# EAGLE schematic aw_101_alarm (EAGLE 6.4)
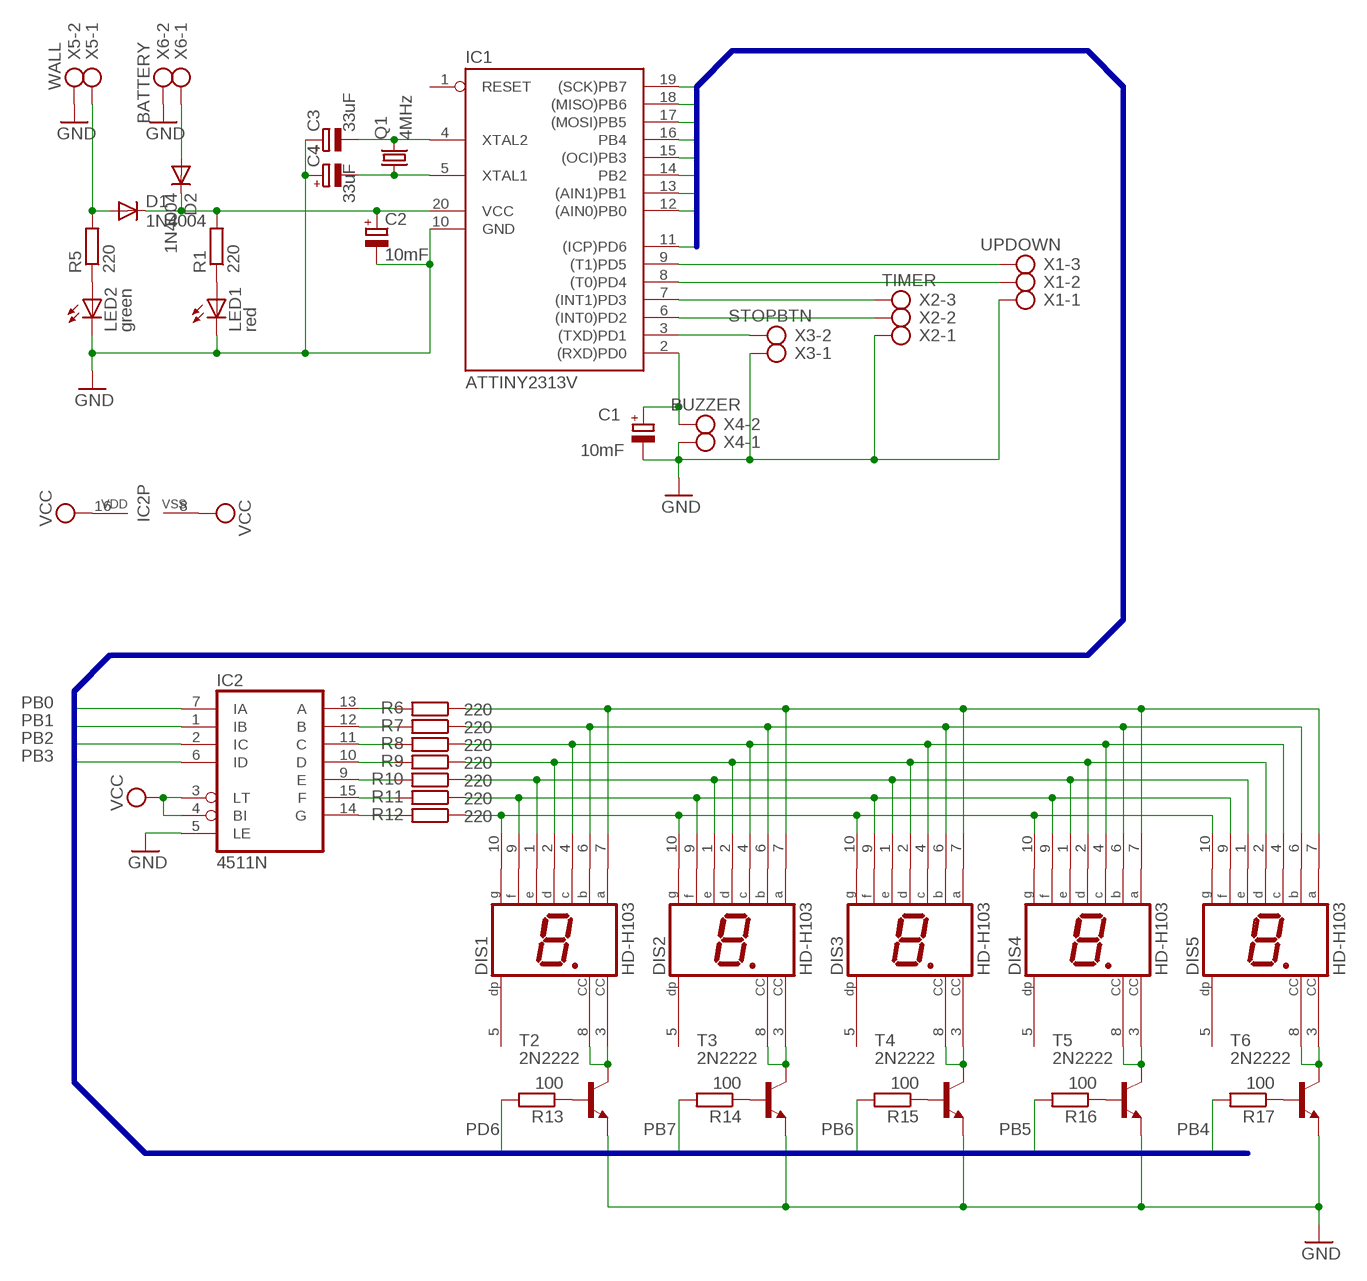
[diagram p0: schematic, sheet 1]

## Parts
C1  10mF  CPOL-EUE2.5-6  [E2,5-6]
C2  10mF  CPOL-EUE2.5-6  [E2,5-6]
C3  33uF  CPOL-EUE2.5-6  [E2,5-6]
C4  33uF  CPOL-EUE2.5-6  [E2,5-6]
D1  1N4004  [DO41-10]
D2  1N4004  [DO41-10]
DIS1  HD-H103  [HDSP-M]
DIS2  HD-H103  [HDSP-M]
DIS3  HD-H103  [HDSP-M]
DIS4  HD-H103  [HDSP-M]
DIS5  HD-H103  [HDSP-M]
IC1  ATTINY2313V  AT90S2313P  [DIL20]
IC2  4511N  [DIL16]
LED1  red  LED5MM  [LED5MM]
LED2  green  LED5MM  [LED5MM]
Q1  4MHz  CRYSTALHC49U70  [HC49U70]
R1  220  R-EU_0207/10  [0207/10]
R5  220  R-EU_0207/10  [0207/10]
R6  220  R-EU_0207/10  [0207/10]
R7  220  R-EU_0207/10  [0207/10]
R8  220  R-EU_0207/10  [0207/10]
R9  220  R-EU_0207/10  [0207/10]
R10  220  R-EU_0207/10  [0207/10]
R11  220  R-EU_0207/10  [0207/10]
R12  220  R-EU_0207/10  [0207/10]
R13  100  R-EU_0207/10  [0207/10]
R14  100  R-EU_0207/10  [0207/10]
R15  100  R-EU_0207/10  [0207/10]
R16  100  R-EU_0207/10  [0207/10]
R17  100  R-EU_0207/10  [0207/10]
T2  2N2222  [TO18]
T3  2N2222  [TO18]
T4  2N2222  [TO18]
T5  2N2222  [TO18]
T6  2N2222  [TO18]
X1  UPDOWN  AK500/3  [AK500/3]
X2  TIMER  AK500/3  [AK500/3]
X3  STOPBTN  AK500/2  [AK500/2]
X4  BUZZER  AK500/2  [AK500/2]
X5  WALL  AK500/2  [AK500/2]
X6  BATTERY  AK500/2  [AK500/2]

## Nets
GND: C1.- C2.- C3.+ C4.+ IC1.10(GND) IC2.5(LE) LED1.K(C) LED2.K(C) T2.1(E) T3.1(E) T4.1(E) T5.1(E) T6.1(E) X1.1 X2.1 X3.1 X4.1 X5.2 X6.2
N$1: IC1.9((T1)PD5) X1.3
N$2: D1.A R5.2 X5.1
N$3: D2.A X6.1
N$4: LED1.A R1.1
N$5: C4.- IC1.5(XTAL1) Q1.1
N$6: IC1.8((T0)PD4) X1.2
N$7: IC1.7((INT1)PD3) X2.3
N$8: IC1.6((INT0)PD2) X2.2
N$9: IC1.3((TXD)PD1) X3.2
N$10: C1.+ IC1.2((RXD)PD0) X4.2
N$11: C3.- IC1.4(XTAL2) Q1.2
N$13: DIS2.3(CC) DIS2.8(CC) T3.3(C)
N$14: DIS3.3(CC) DIS3.8(CC) T4.3(C)
N$15: IC2.13(A) R6.2
N$16: IC2.12(B) R7.2
N$17: IC2.11(C) R8.2
N$18: IC2.10(D) R9.2
N$19: IC2.9(E) R10.2
N$20: IC2.15(F) R11.2
N$21: IC2.14(G) R12.2
N$22: DIS1.10(G) DIS2.10(G) DIS3.10(G) DIS4.10(G) DIS5.10(G) R12.1
N$23: DIS1.9(F) DIS2.9(F) DIS3.9(F) DIS4.9(F) DIS5.9(F) R11.1
N$24: DIS1.1(E) DIS2.1(E) DIS3.1(E) DIS4.1(E) DIS5.1(E) R10.1
N$25: DIS1.2(D) DIS2.2(D) DIS3.2(D) DIS4.2(D) DIS5.2(D) R9.1
N$26: DIS1.4(C) DIS2.4(C) DIS3.4(C) DIS4.4(C) DIS5.4(C) R8.1
N$27: DIS1.6(B) DIS2.6(B) DIS3.6(B) DIS4.6(B) DIS5.6(B) R7.1
N$28: DIS1.7(A) DIS2.7(A) DIS3.7(A) DIS4.7(A) DIS5.7(A) R6.1
N$29: DIS1.3(CC) DIS1.8(CC) T2.3(C)
N$30: R13.1 T2.2(B)
N$31: R14.1 T3.2(B)
N$32: R15.1 T4.2(B)
N$33: R16.1 T5.2(B)
N$34: R17.1 T6.2(B)
N$35: DIS4.3(CC) DIS4.8(CC) T5.3(C)
N$36: DIS5.3(CC) DIS5.8(CC) T6.3(C)
N$37: LED2.A R5.1
PB0: IC1.12((AIN0)PB0) IC2.7(IA)
PB1: IC1.13((AIN1)PB1) IC2.1(IB)
PB2: IC1.14(PB2) IC2.2(IC)
PB3: IC1.15((OCI)PB3) IC2.6(ID)
PB4: IC1.16(PB4) R17.2
PB5: IC1.17((MOSI)PB5) R16.2
PB6: IC1.18((MISO)PB6) R15.2
PB7: IC1.19((SCK)PB7) R14.2
PD6: IC1.11((ICP)PD6) R13.2
VCC: C2.+ D1.C D2.C IC1.20(VCC) IC2.3(LT) IC2.4(BI) IC2.8(VSS) IC2.16(VDD) R1.2
Unconnected: DIS1.5(DP) DIS2.5(DP) DIS3.5(DP) DIS4.5(DP) DIS5.5(DP) IC1.1(RESET)

## Buses
PB[0..7],PD6

## Library data of the parts
C1-C4 = rcl:CPOL-EU: POLARIZED CAPACITOR, European symbol
D1 D2 = diode:1N4004: DIODE general purpose rectifier, 1 A
DIS1-DIS5 = display-hp:HD-H103: LED DISPLAY 1-character 7 segment, decimal point right; OC_FARNELL: unknown; OC_NEWARK: unknown
IC1 = atmel:AT90S2313: MICROCONTROLLER 2 Kbytes FLASH 128 bytes SRAM 128 bytes EEPROM UART; OC_FARNELL: unknown; OC_NEWARK: unknown
IC2 = 45xx:4511: BCD to 7-segment LATCH/DECODER/DRIVER
LED1 LED2 = led:LED: LED OSRAM: - CHIPLED LG R971, LG N971, LY N971, LG Q971, LY Q971, LO R971, LY R971 LH N974, LH R974 LS Q976, LO Q976, LY Q976 LO Q996 - Hyper CHIPLED LW Q18S LB Q993, LB Q99A, LB R99A - SideLED LS A670, LO A670, LY A670, LG A670, LP A670 LB A673, LV A673, LT A673, LW A673 LH A674 LY A675 LS A676, LA A676, LO A676, LY A676, LW A676 LS A679, LY A679, LG A679 - Hyper Micro SIDELED® LS Y876, LA Y876, LO Y876, LY Y876 LT Y87S - SmartLED LW L88C, LW L88S LB L89C, LB L89S, LG L890 LS L89K, LO L89K, LY L89K LS L896, LA L896, LO L896, LY L896 - TOPLED LS T670, LO T670, LY T670, LG T670, LP T670 LSG T670, LSP T670, LSY T670, LOP T670, LYG T670 LG T671, LOG T671, LSG T671 LB T673, LV T673, LT T673, LW T673 LH T674 LS T676, LA T676, LO T676, LY T676, LB T676, LH T676, LSB T676, LW T676 LB T67C, LV T67C, LT T67C, LS T67K, LO T67K, LY T67K, LW E67C LS E67B, LA E67B, LO E67B, LY E67B, LB E67C, LV E67C, LT E67C LW T67C LS T679, LY T679, LG T679 LS T770, LO T770, LY T770, LG T770, LP T770 LB T773, LV T773, LT T773, LW T773 LH T774 LS E675, LA E675, LY E675, LS T675 LS T776, LA T776, LO T776, LY T776, LB T776 LHGB T686 LT T68C, LB T68C - Hyper Mini TOPLED® LB M676 - Mini TOPLED Santana® LG M470 LS M47K, LO M47K, LY M47K Source: http://www.osram.convergy.de LUXEON: - LUMILED® LXK2-PW12-R00, LXK2-PW12-S00, LXK2-PW14-U00, LXK2-PW14-V00 LXK2-PM12-R00, LXK2-PM12-S00, LXK2-PM14-U00 LXK2-PE12-Q00, LXK2-PE12-R00, LXK2-PE12-S00, LXK2-PE14-T00, LXK2-PE14-U00 LXK2-PB12-K00, LXK2-PB12-L00, LXK2-PB12-M00, LXK2-PB14-N00, LXK2-PB14-P00, LXK2-PB14-Q00 LXK2-PR12-L00, LXK2-PR12-M00, LXK2-PR14-Q00, LXK2-PR14-R00 LXK2-PD12-Q00, LXK2-PD12-R00, LXK2-PD12-S00 LXK2-PH12-R00, LXK2-PH12-S00 LXK2-PL12-P00, LXK2-PL12-Q00, LXK2-PL12-R00 Source: www.luxeon.com KINGBRIGHT: KA-3528ASYC Source: www.kingbright.com
Q1 = crystal:CRYSTAL: CRYSTAL; OC_FARNELL: unknown; OC_NEWARK: unknown
R1 R5-R17 = rcl:R-EU_: RESISTOR, European symbol
T2-T6 = transistor:2N2222: NPN TRANSISTOR
X1 X2 = con-ptr500:AK500/3: CONNECTOR; OC_FARNELL: unknown; OC_NEWARK: unknown
X3-X6 = con-ptr500:AK500/2: CONNECTOR; OC_FARNELL: unknown; OC_NEWARK: unknown

## Net classes
0 default: width 1.016 mm, clearance 1.016 mm